# EAGLE schematic UCirKit30x20-0721 (EAGLE 6.5.0)
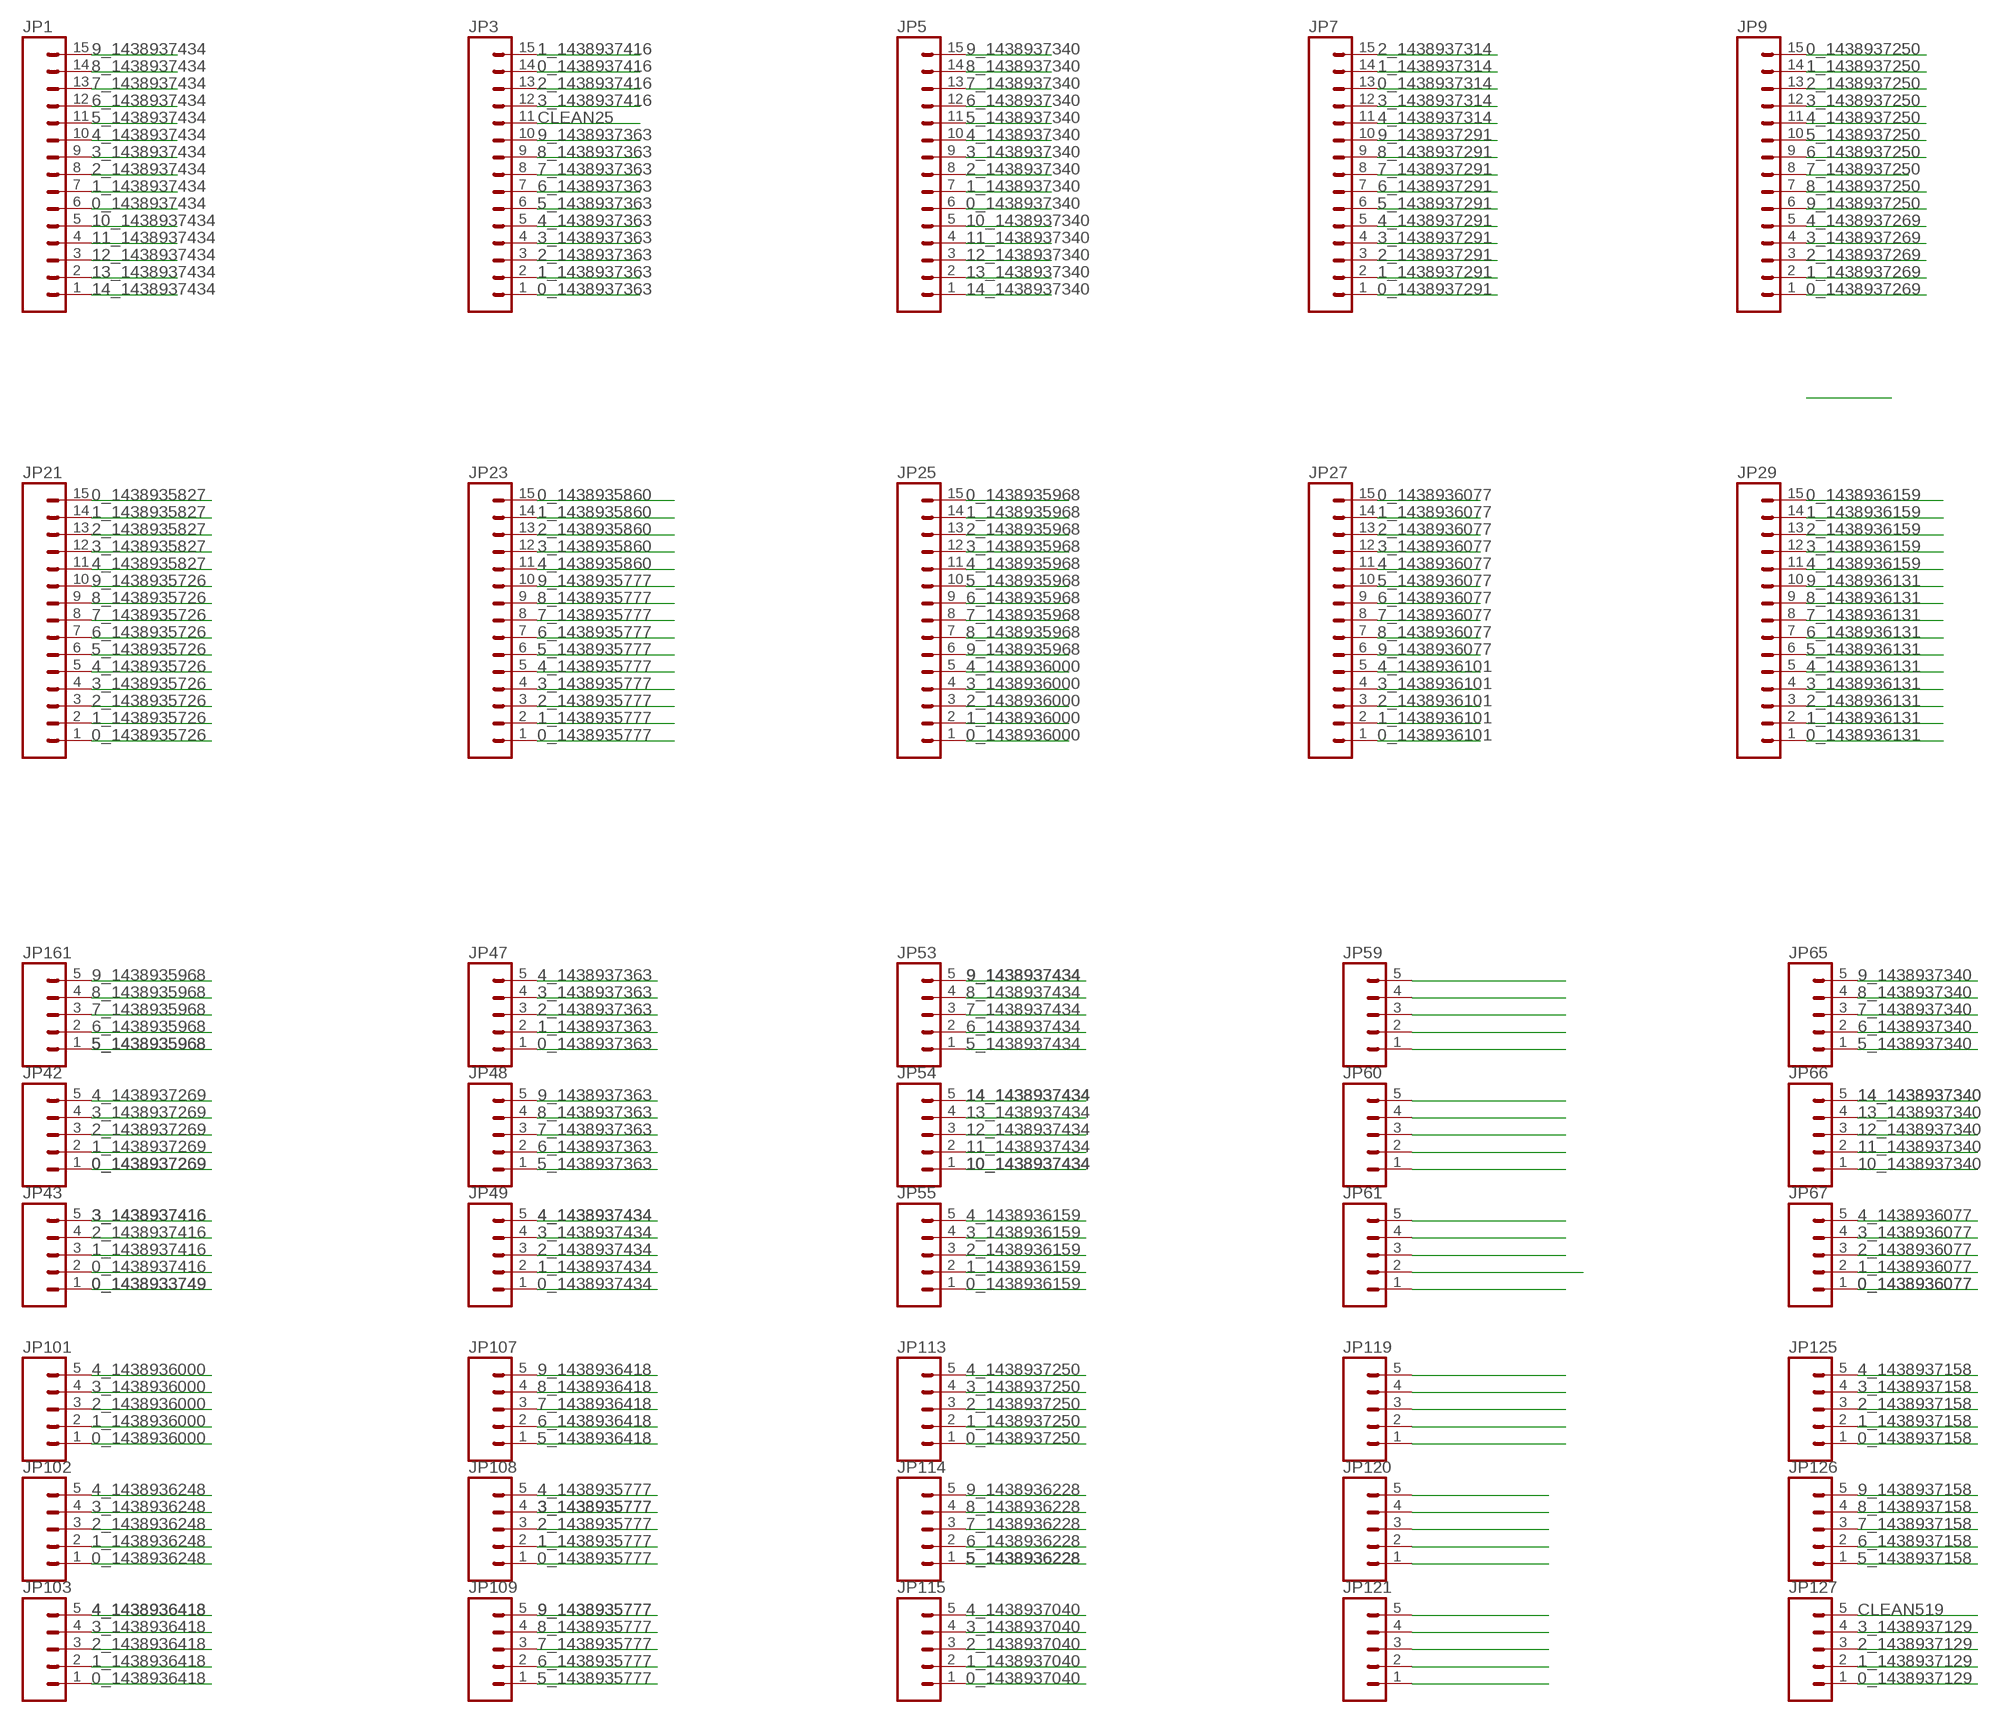
[diagram p0: schematic, sheet 1, part 1 of 2]
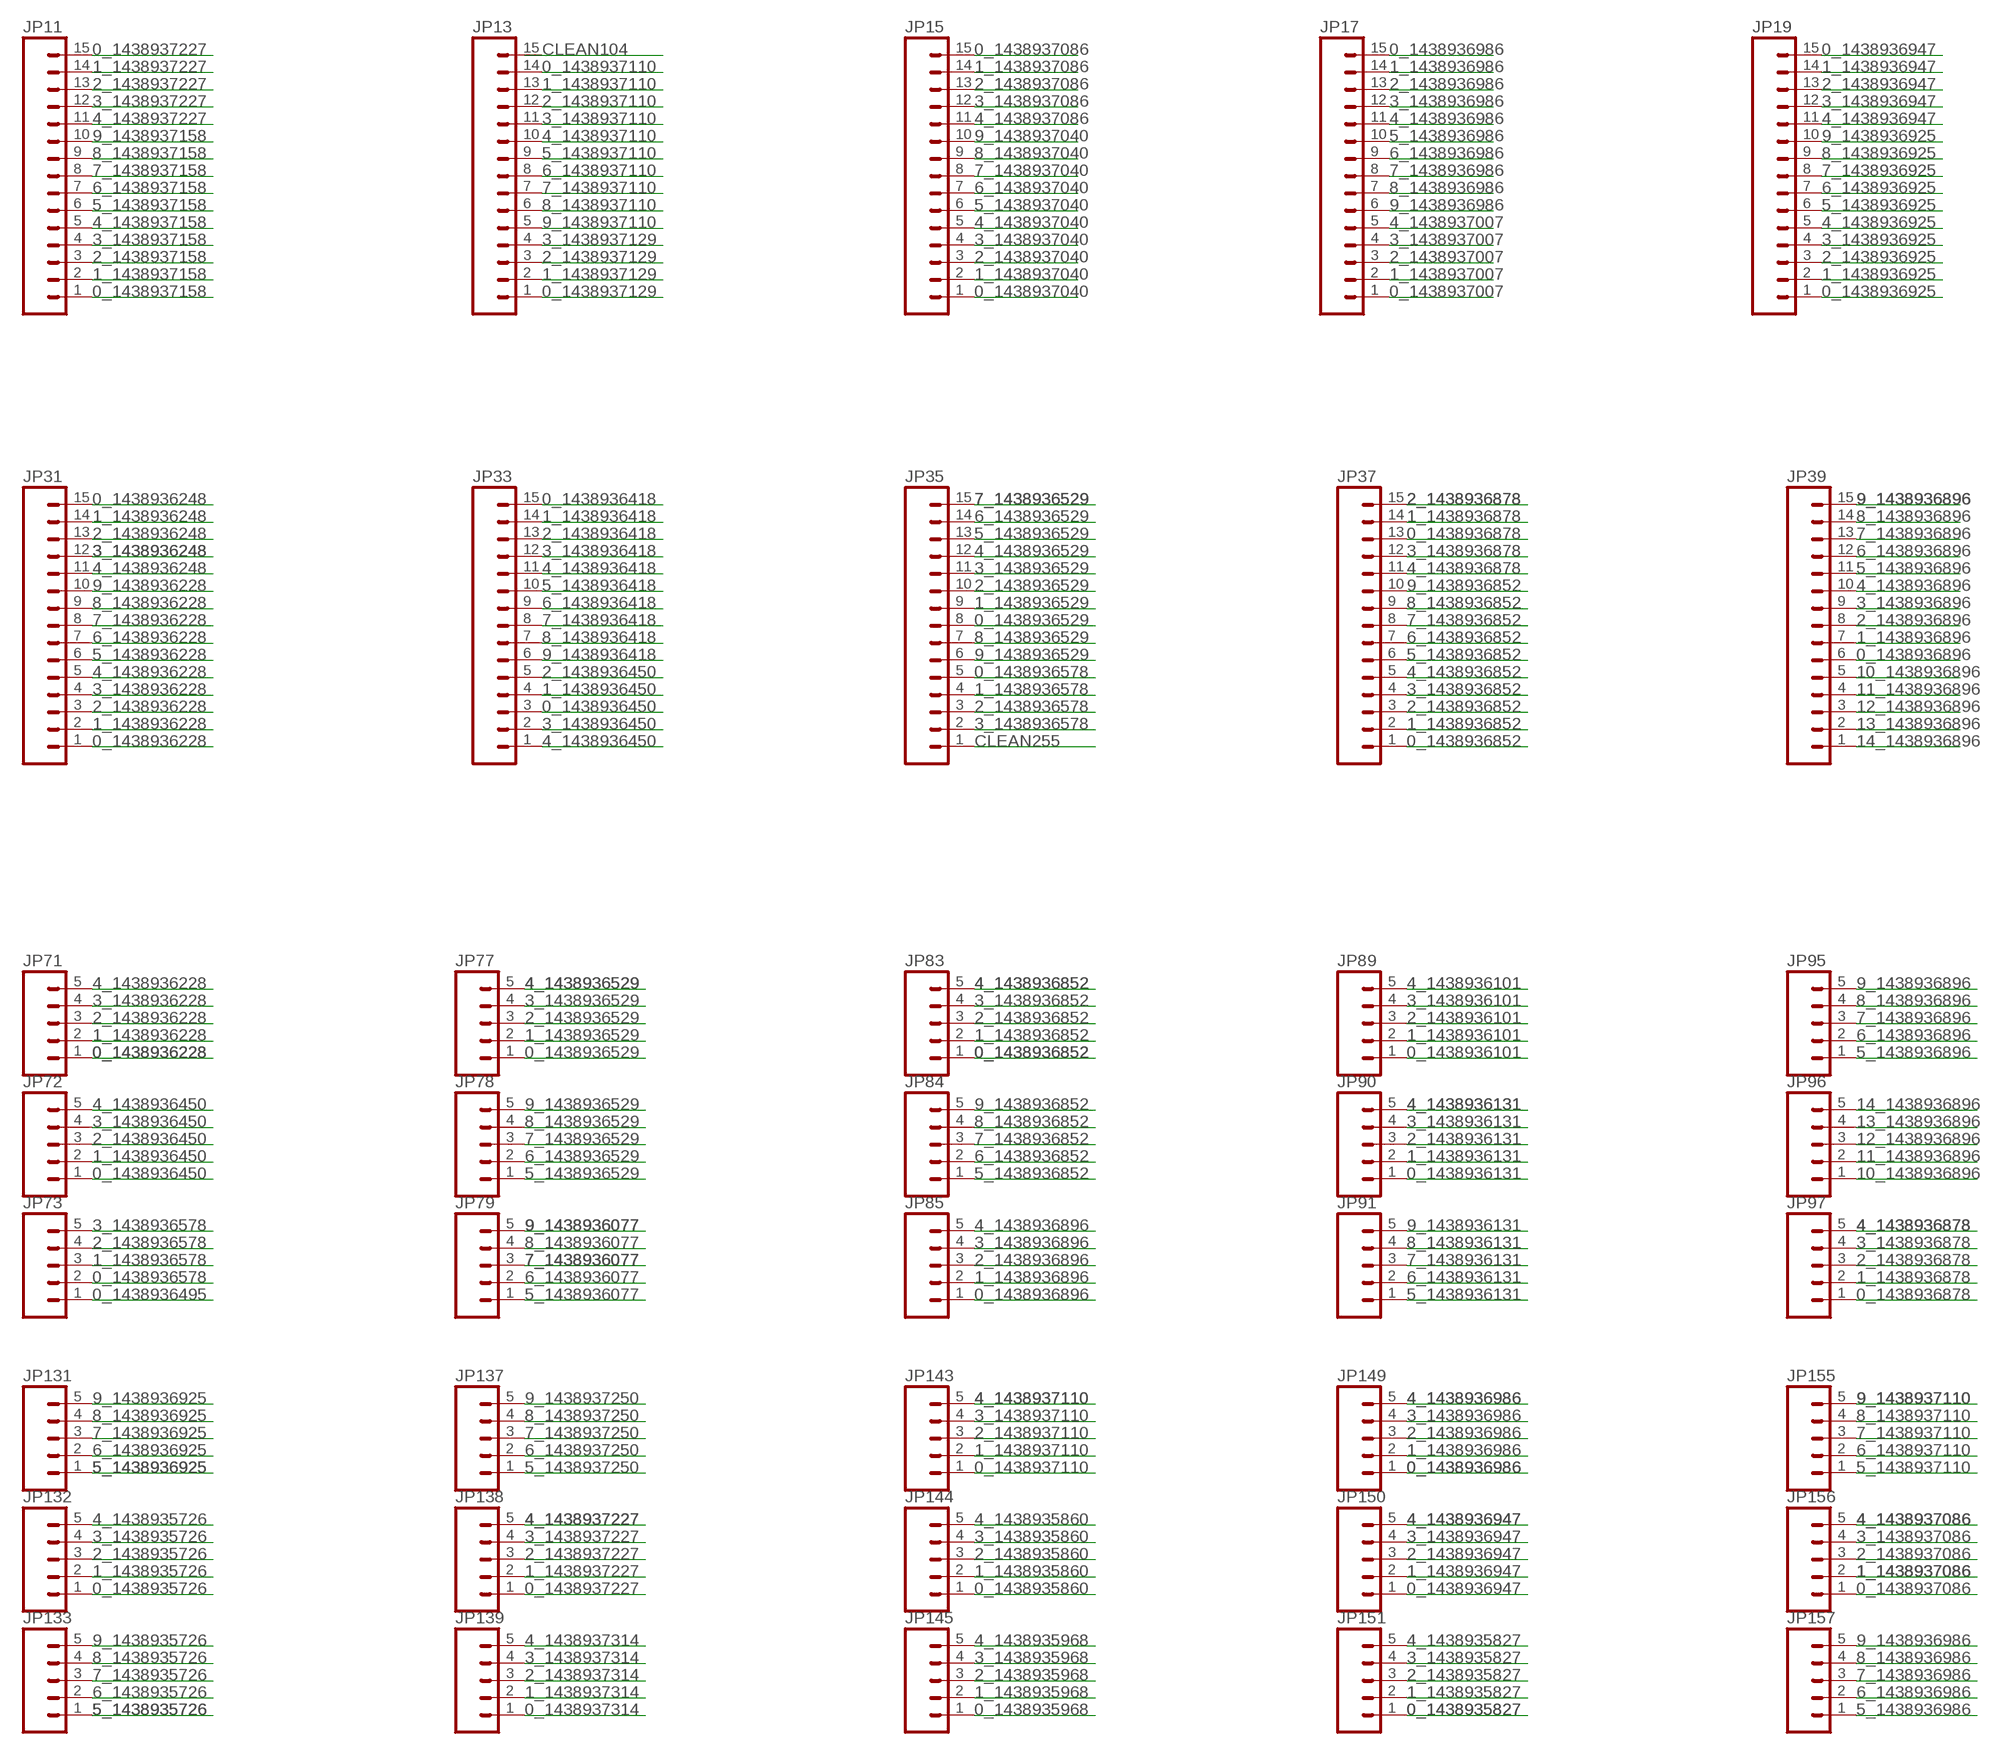
[diagram p1: schematic, sheet 1, part 2 of 2]

## Parts
JP1  M15  [1X15]
JP3  M15  [1X15]
JP5  M15  [1X15]
JP7  M15  [1X15]
JP9  M15  [1X15]
JP11  M15  [1X15]
JP13  M15  [1X15]
JP15  M15  [1X15]
JP17  M15  [1X15]
JP19  M15  [1X15]
JP21  M15  [1X15]
JP23  M15  [1X15]
JP25  M15  [1X15]
JP27  M15  [1X15]
JP29  M15  [1X15]
JP31  M15  [1X15]
JP33  M15  [1X15]
JP35  M15  [1X15]
JP37  M15  [1X15]
JP39  M15  [1X15]
JP42  M051.27MM  [1X05-1.27MM]
JP43  M051.27MM  [1X05-1.27MM]
JP47  M051.27MM  [1X05-1.27MM]
JP48  M051.27MM  [1X05-1.27MM]
JP49  M051.27MM  [1X05-1.27MM]
JP53  M051.27MM  [1X05-1.27MM]
JP54  M051.27MM  [1X05-1.27MM]
JP55  M051.27MM  [1X05-1.27MM]
JP59  M051.27MM  [1X05-1.27MM]
JP60  M051.27MM  [1X05-1.27MM]
JP61  M051.27MM  [1X05-1.27MM]
JP65  M051.27MM  [1X05-1.27MM]
JP66  M051.27MM  [1X05-1.27MM]
JP67  M051.27MM  [1X05-1.27MM]
JP71  M051.27MM  [1X05-1.27MM]
JP72  M051.27MM  [1X05-1.27MM]
JP73  M051.27MM  [1X05-1.27MM]
JP77  M051.27MM  [1X05-1.27MM]
JP78  M051.27MM  [1X05-1.27MM]
JP79  M051.27MM  [1X05-1.27MM]
JP83  M051.27MM  [1X05-1.27MM]
JP84  M051.27MM  [1X05-1.27MM]
JP85  M051.27MM  [1X05-1.27MM]
JP89  M051.27MM  [1X05-1.27MM]
JP90  M051.27MM  [1X05-1.27MM]
JP91  M051.27MM  [1X05-1.27MM]
JP95  M051.27MM  [1X05-1.27MM]
JP96  M051.27MM  [1X05-1.27MM]
JP97  M051.27MM  [1X05-1.27MM]
JP101  M051.27MM  [1X05-1.27MM]
JP102  M051.27MM  [1X05-1.27MM]
JP103  M051.27MM  [1X05-1.27MM]
JP107  M051.27MM  [1X05-1.27MM]
JP108  M051.27MM  [1X05-1.27MM]
JP109  M051.27MM  [1X05-1.27MM]
JP113  M051.27MM  [1X05-1.27MM]
JP114  M051.27MM  [1X05-1.27MM]
JP115  M051.27MM  [1X05-1.27MM]
JP119  M051.27MM  [1X05-1.27MM]
JP120  M051.27MM  [1X05-1.27MM]
JP121  M051.27MM  [1X05-1.27MM]
JP125  M051.27MM  [1X05-1.27MM]
JP126  M051.27MM  [1X05-1.27MM]
JP127  M051.27MM  [1X05-1.27MM]
JP131  M051.27MM  [1X05-1.27MM]
JP132  M051.27MM  [1X05-1.27MM]
JP133  M051.27MM  [1X05-1.27MM]
JP137  M051.27MM  [1X05-1.27MM]
JP138  M051.27MM  [1X05-1.27MM]
JP139  M051.27MM  [1X05-1.27MM]
JP143  M051.27MM  [1X05-1.27MM]
JP144  M051.27MM  [1X05-1.27MM]
JP145  M051.27MM  [1X05-1.27MM]
JP149  M051.27MM  [1X05-1.27MM]
JP150  M051.27MM  [1X05-1.27MM]
JP151  M051.27MM  [1X05-1.27MM]
JP155  M051.27MM  [1X05-1.27MM]
JP156  M051.27MM  [1X05-1.27MM]
JP157  M051.27MM  [1X05-1.27MM]
JP161  M051.27MM  [1X05-1.27MM]

## Nets
0_1438933749: JP43.1
0_1438935726: JP21.1 JP132.1
0_1438935777: JP23.1 JP108.1
0_1438935827: JP21.15 JP151.1
0_1438935860: JP23.15 JP144.1
0_1438935968: JP25.15 JP145.1
0_1438936000: JP25.1 JP101.1
0_1438936077: JP27.15 JP67.1
0_1438936101: JP27.1 JP89.1
0_1438936131: JP29.1 JP90.1
0_1438936159: JP29.15 JP55.1
0_1438936228: JP31.1 JP71.1
0_1438936248: JP31.15 JP102.1
0_1438936418: JP33.15 JP103.1
0_1438936450: JP33.3 JP72.1
0_1438936495: JP73.1
0_1438936529: JP35.8 JP77.1
0_1438936578: JP35.5 JP73.2
0_1438936852: JP37.1 JP83.1
0_1438936878: JP37.13 JP97.1
0_1438936896: JP39.6 JP85.1
0_1438936925: JP19.1 JP121.1
0_1438936947: JP19.15 JP150.1
0_1438936986: JP17.15 JP149.1
0_1438937007: JP17.1 JP120.1
0_1438937040: JP15.1 JP115.1
0_1438937086: JP15.15 JP156.1
0_1438937110: JP13.14 JP143.1
0_1438937129: JP13.1 JP127.1
0_1438937158: JP11.1 JP125.1
0_1438937227: JP11.15 JP138.1
0_1438937250: JP9.15 JP113.1
0_1438937269: JP9.1 JP42.1
0_1438937291: JP7.1 JP59.1
0_1438937314: JP7.13 JP139.1
0_1438937340: JP5.6 JP61.1
0_1438937363: JP3.1 JP47.1
0_1438937416: JP3.14 JP43.2
0_1438937434: JP1.6 JP49.1
1_1438935726: JP21.2 JP132.2
1_1438935777: JP23.2 JP108.2
1_1438935827: JP21.14 JP151.2
1_1438935860: JP23.14 JP144.2
1_1438935968: JP25.14 JP145.2
1_1438936000: JP25.2 JP101.2
1_1438936077: JP27.14 JP67.2
1_1438936101: JP27.2 JP89.2
1_1438936131: JP29.2 JP90.2
1_1438936159: JP29.14 JP55.2
1_1438936228: JP31.2 JP71.2
1_1438936248: JP31.14 JP102.2
1_1438936418: JP33.14 JP103.2
1_1438936450: JP33.4 JP72.2
1_1438936529: JP35.9 JP77.2
1_1438936578: JP35.4 JP73.3
1_1438936852: JP37.2 JP83.2
1_1438936878: JP37.14 JP97.2
1_1438936896: JP39.7 JP85.2
1_1438936925: JP19.2 JP121.2
1_1438936947: JP19.14 JP150.2
1_1438936986: JP17.14 JP149.2
1_1438937007: JP17.2 JP120.2
1_1438937040: JP15.2 JP115.2
1_1438937086: JP15.14 JP156.2
1_1438937110: JP13.13 JP143.2
1_1438937129: JP13.2 JP127.2
1_1438937158: JP11.2 JP125.2
1_1438937227: JP11.14 JP138.2
1_1438937250: JP9.14 JP113.2
1_1438937269: JP9.2 JP42.2
1_1438937291: JP7.2 JP59.2
1_1438937314: JP7.14 JP139.2
1_1438937340: JP5.7 JP61.2
1_1438937363: JP3.2 JP47.2
1_1438937416: JP3.15 JP43.3
1_1438937434: JP1.7 JP49.2
2_1438935726: JP21.3 JP132.3
2_1438935777: JP23.3 JP108.3
2_1438935827: JP21.13 JP151.3
2_1438935860: JP23.13 JP144.3
2_1438935968: JP25.13 JP145.3
2_1438936000: JP25.3 JP101.3
2_1438936077: JP27.13 JP67.3
2_1438936101: JP27.3 JP89.3
2_1438936131: JP29.3 JP90.3
2_1438936159: JP29.13 JP55.3
2_1438936228: JP31.3 JP71.3
2_1438936248: JP31.13 JP102.3
2_1438936418: JP33.13 JP103.3
2_1438936450: JP33.5 JP72.3
2_1438936529: JP35.10 JP77.3
2_1438936578: JP35.3 JP73.4
2_1438936852: JP37.3 JP83.3
2_1438936878: JP37.15 JP97.3
2_1438936896: JP39.8 JP85.3
2_1438936925: JP19.3 JP121.3
2_1438936947: JP19.13 JP150.3
2_1438936986: JP17.13 JP149.3
2_1438937007: JP17.3 JP120.3
2_1438937040: JP15.3 JP115.3
2_1438937086: JP15.13 JP156.3
2_1438937110: JP13.12 JP143.3
2_1438937129: JP13.3 JP127.3
2_1438937158: JP11.3 JP125.3
2_1438937227: JP11.13 JP138.3
2_1438937250: JP9.13 JP113.3
2_1438937269: JP9.3 JP42.3
2_1438937291: JP7.3 JP59.3
2_1438937314: JP7.15 JP139.3
2_1438937340: JP5.8 JP61.3
2_1438937363: JP3.3 JP47.3
2_1438937416: JP3.13 JP43.4
2_1438937434: JP1.8 JP49.3
3_1438935726: JP21.4 JP132.4
3_1438935777: JP23.4 JP108.4
3_1438935827: JP21.12 JP151.4
3_1438935860: JP23.12 JP144.4
3_1438935968: JP25.12 JP145.4
3_1438936000: JP25.4 JP101.4
3_1438936077: JP27.12 JP67.4
3_1438936101: JP27.4 JP89.4
3_1438936131: JP29.4 JP90.4
3_1438936159: JP29.12 JP55.4
3_1438936228: JP31.4 JP71.4
3_1438936248: JP31.12 JP102.4
3_1438936418: JP33.12 JP103.4
3_1438936450: JP33.2 JP72.4
3_1438936529: JP35.11 JP77.4
3_1438936578: JP35.2 JP73.5
3_1438936852: JP37.4 JP83.4
3_1438936878: JP37.12 JP97.4
3_1438936896: JP39.9 JP85.4
3_1438936925: JP19.4 JP121.4
3_1438936947: JP19.12 JP150.4
3_1438936986: JP17.12 JP149.4
3_1438937007: JP17.4 JP120.4
3_1438937040: JP15.4 JP115.4
3_1438937086: JP15.12 JP156.4
3_1438937110: JP13.11 JP143.4
3_1438937129: JP13.4 JP127.4
3_1438937158: JP11.4 JP125.4
3_1438937227: JP11.12 JP138.4
3_1438937250: JP9.12 JP113.4
3_1438937269: JP9.4 JP42.4
3_1438937291: JP7.4 JP59.4
3_1438937314: JP7.12 JP139.4
3_1438937340: JP5.9 JP61.4
3_1438937363: JP3.4 JP47.4
3_1438937416: JP3.12 JP43.5
3_1438937434: JP1.9 JP49.4
4_1438935726: JP21.5 JP132.5
4_1438935777: JP23.5 JP108.5
4_1438935827: JP21.11 JP151.5
4_1438935860: JP23.11 JP144.5
4_1438935968: JP25.11 JP145.5
4_1438936000: JP25.5 JP101.5
4_1438936077: JP27.11 JP67.5
4_1438936101: JP27.5 JP89.5
4_1438936131: JP29.5 JP90.5
4_1438936159: JP29.11 JP55.5
4_1438936228: JP31.5 JP71.5
4_1438936248: JP31.11 JP102.5
4_1438936418: JP33.11 JP103.5
4_1438936450: JP33.1 JP72.5
4_1438936529: JP35.12 JP77.5
4_1438936852: JP37.5 JP83.5
4_1438936878: JP37.11 JP97.5
4_1438936896: JP39.10 JP85.5
4_1438936925: JP19.5 JP121.5
4_1438936947: JP19.11 JP150.5
4_1438936986: JP17.11 JP149.5
4_1438937007: JP17.5 JP120.5
4_1438937040: JP15.5 JP115.5
4_1438937086: JP15.11 JP156.5
4_1438937110: JP13.10 JP143.5
4_1438937158: JP11.5 JP125.5
4_1438937227: JP11.11 JP138.5
4_1438937250: JP9.11 JP113.5
4_1438937269: JP9.5 JP42.5
4_1438937291: JP7.5 JP59.5
4_1438937314: JP7.11 JP139.5
4_1438937340: JP5.10 JP61.5
4_1438937363: JP3.5 JP47.5
4_1438937434: JP1.10 JP49.5
5_1438935726: JP21.6 JP133.1
5_1438935777: JP23.6 JP109.1
5_1438935968: JP25.10 JP161.1
5_1438936077: JP27.10 JP79.1
5_1438936131: JP29.6 JP91.1
5_1438936228: JP31.6 JP114.1
5_1438936418: JP33.10 JP107.1
5_1438936529: JP35.13 JP78.1
5_1438936852: JP37.6 JP84.1
5_1438936896: JP39.11 JP95.1
5_1438936925: JP19.6 JP131.1
5_1438936986: JP17.10 JP157.1
5_1438937040: JP15.6 JP119.1
5_1438937110: JP13.9 JP155.1
5_1438937158: JP11.6 JP126.1
5_1438937250: JP9.10 JP137.1
5_1438937291: JP7.6 JP60.1
5_1438937340: JP5.11 JP65.1
5_1438937363: JP3.6 JP48.1
5_1438937434: JP1.11 JP53.1
6_1438935726: JP21.7 JP133.2
6_1438935777: JP23.7 JP109.2
6_1438935968: JP25.9 JP161.2
6_1438936077: JP27.9 JP79.2
6_1438936131: JP29.7 JP91.2
6_1438936228: JP31.7 JP114.2
6_1438936418: JP33.9 JP107.2
6_1438936529: JP35.14 JP78.2
6_1438936852: JP37.7 JP84.2
6_1438936896: JP39.12 JP95.2
6_1438936925: JP19.7 JP131.2
6_1438936986: JP17.9 JP157.2
6_1438937040: JP15.7 JP119.2
6_1438937110: JP13.8 JP155.2
6_1438937158: JP11.7 JP126.2
6_1438937250: JP9.9 JP137.2
6_1438937291: JP7.7 JP60.2
6_1438937340: JP5.12 JP65.2
6_1438937363: JP3.7 JP48.2
6_1438937434: JP1.12 JP53.2
7_1438935726: JP21.8 JP133.3
7_1438935777: JP23.8 JP109.3
7_1438935968: JP25.8 JP161.3
7_1438936077: JP27.8 JP79.3
7_1438936131: JP29.8 JP91.3
7_1438936228: JP31.8 JP114.3
7_1438936418: JP33.8 JP107.3
7_1438936529: JP35.15 JP78.3
7_1438936852: JP37.8 JP84.3
7_1438936896: JP39.13 JP95.3
7_1438936925: JP19.8 JP131.3
7_1438936986: JP17.8 JP157.3
7_1438937040: JP15.8 JP119.3
7_1438937110: JP13.7 JP155.3
7_1438937158: JP11.8 JP126.3
7_1438937250: JP9.8 JP137.3
7_1438937291: JP7.8 JP60.3
7_1438937340: JP5.13 JP65.3
7_1438937363: JP3.8 JP48.3
7_1438937434: JP1.13 JP53.3
8_1438935726: JP21.9 JP133.4
8_1438935777: JP23.9 JP109.4
8_1438935968: JP25.7 JP161.4
8_1438936077: JP27.7 JP79.4
8_1438936131: JP29.9 JP91.4
8_1438936228: JP31.9 JP114.4
8_1438936418: JP33.7 JP107.4
8_1438936529: JP35.7 JP78.4
8_1438936852: JP37.9 JP84.4
8_1438936896: JP39.14 JP95.4
8_1438936925: JP19.9 JP131.4
8_1438936986: JP17.7 JP157.4
8_1438937040: JP15.9 JP119.4
8_1438937110: JP13.6 JP155.4
8_1438937158: JP11.9 JP126.4
8_1438937250: JP9.7 JP137.4
8_1438937291: JP7.9 JP60.4
8_1438937340: JP5.14 JP65.4
8_1438937363: JP3.9 JP48.4
8_1438937434: JP1.14 JP53.4
9_1438935726: JP21.10 JP133.5
9_1438935777: JP23.10 JP109.5
9_1438935968: JP25.6 JP161.5
9_1438936077: JP27.6 JP79.5
9_1438936131: JP29.10 JP91.5
9_1438936228: JP31.10 JP114.5
9_1438936418: JP33.6 JP107.5
9_1438936529: JP35.6 JP78.5
9_1438936852: JP37.10 JP84.5
9_1438936896: JP39.15 JP95.5
9_1438936925: JP19.10 JP131.5
9_1438936986: JP17.6 JP157.5
9_1438937040: JP15.10 JP119.5
9_1438937110: JP13.5 JP155.5
9_1438937158: JP11.10 JP126.5
9_1438937250: JP9.6 JP137.5
9_1438937291: JP7.10 JP60.5
9_1438937340: JP5.15 JP65.5
9_1438937363: JP3.10 JP48.5
9_1438937434: JP1.15 JP53.5
10_1438936896: JP39.5 JP96.1
10_1438937340: JP5.5 JP66.1
10_1438937434: JP1.5 JP54.1
11_1438936896: JP39.4 JP96.2
11_1438937340: JP5.4 JP66.2
11_1438937434: JP1.4 JP54.2
12_1438936896: JP39.3 JP96.3
12_1438937340: JP5.3 JP66.3
12_1438937434: JP1.3 JP54.3
13_1438936896: JP39.2 JP96.4
13_1438937340: JP5.2 JP66.4
13_1438937434: JP1.2 JP54.4
14_1438936896: JP39.1 JP96.5
14_1438937340: JP5.1 JP66.5
14_1438937434: JP1.1 JP54.5
CLEAN25: JP3.11
CLEAN255: JP35.1
CLEAN519: JP127.5
Unconnected: JP13.15

## Library data of the parts
JP1 JP3 JP5 JP7 JP9 JP11 JP13 JP15 JP17 JP19 JP21 JP23 JP25 JP27 JP29 JP31 JP33 JP35 JP37 JP39 = SparkFun-Connectors:M15: Header 15 Standard 15-pin 0.1" header. Use with straight break away headers (SKU : PRT-00116), right angle break away headers (PRT-00553), swiss pins (PRT-00743), machine pins (PRT-00117), and female headers (PRT-00115).
JP42 JP43 JP47-JP49 JP53-JP55 JP59-JP61 JP65-JP67 JP71-JP73 JP77-JP79 JP83-JP85 JP89-JP91 JP95-JP97 JP101-JP103 JP107-JP109 JP113-JP115 JP119-JP121 JP125-JP127 JP131-JP133 JP137-JP139 JP143-JP145 JP149-JP151 JP155-JP157 JP161 = SparkFun-Connectors:M05: Header 5 Standard 5-pin 0.1" header. Use with straight break away headers (SKU : PRT-00116), right angle break away headers (PRT-00553), swiss pins (PRT-00743), machine pins (PRT-00117), and female headers (PRT-00115). Molex polarized connector foot print use with SKU : PRT-08230 with associated crimp pins and housings.